# Altium schematic sheet x-.SchDoc
size B
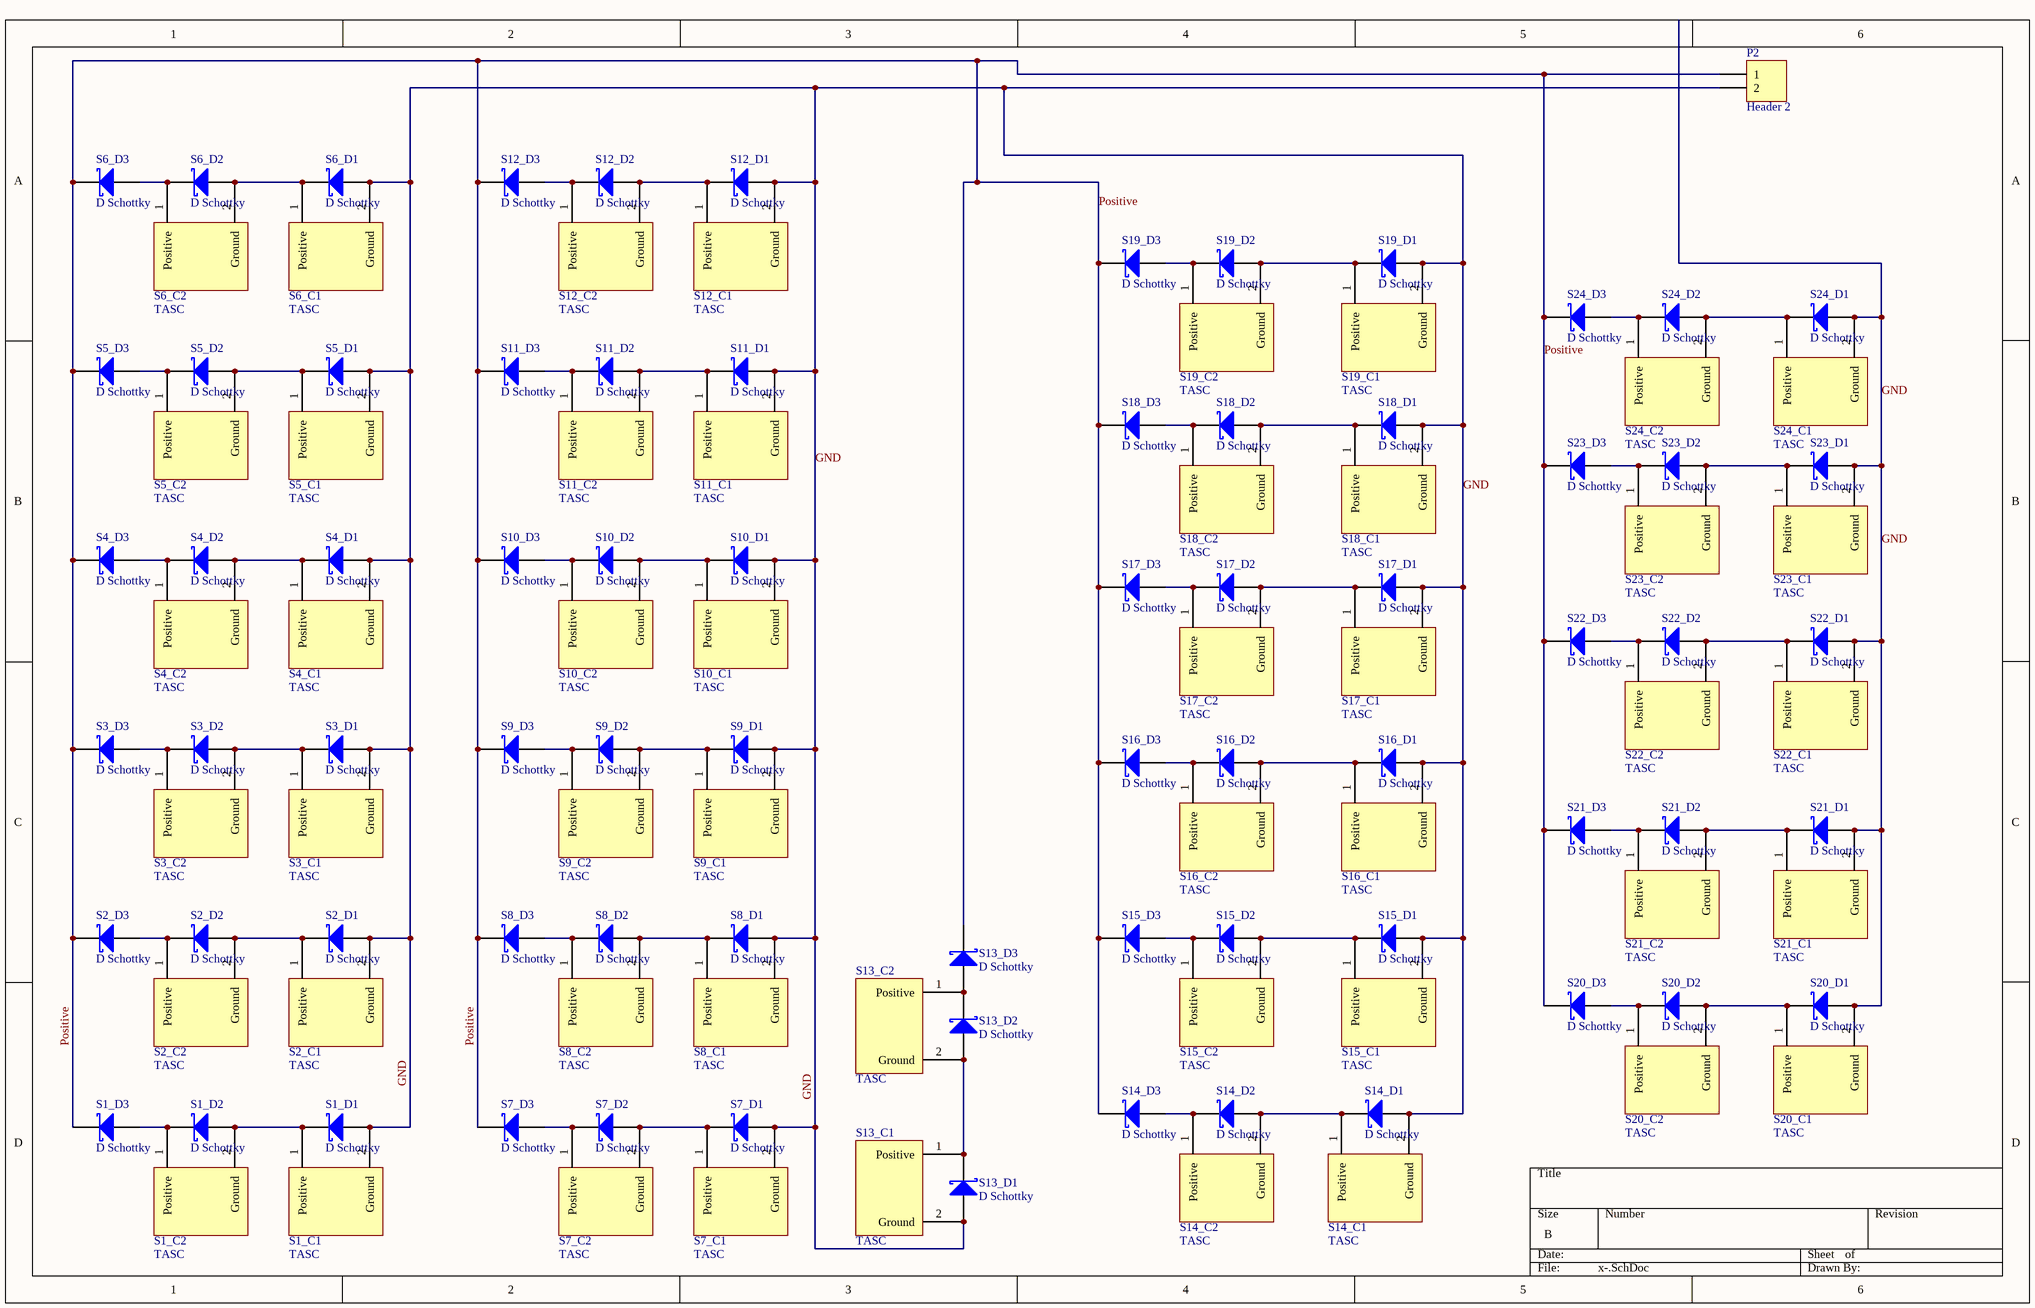
[diagram p0: x-.SchDoc]

## Parts
P2  Header 2  [HDR1X2]
S1_C1  TASC  [PCBComponent_1]
S1_C2  TASC  [PCBComponent_1]
S1_D1  D Schottky  [SMB]
S1_D2  D Schottky  [SMB]
S1_D3  D Schottky  [SMB]
S2_C1  TASC  [PCBComponent_1]
S2_C2  TASC  [PCBComponent_1]
S2_D1  D Schottky  [SMB]
S2_D2  D Schottky  [SMB]
S2_D3  D Schottky  [SMB]
S3_C1  TASC  [PCBComponent_1]
S3_C2  TASC  [PCBComponent_1]
S3_D1  D Schottky  [SMB]
S3_D2  D Schottky  [SMB]
S3_D3  D Schottky  [SMB]
S4_C1  TASC  [PCBComponent_1]
S4_C2  TASC  [PCBComponent_1]
S4_D1  D Schottky  [SMB]
S4_D2  D Schottky  [SMB]
S4_D3  D Schottky  [SMB]
S5_C1  TASC  [PCBComponent_1]
S5_C2  TASC  [PCBComponent_1]
S5_D1  D Schottky  [SMB]
S5_D2  D Schottky  [SMB]
S5_D3  D Schottky  [SMB]
S6_C1  TASC  [PCBComponent_1]
S6_C2  TASC  [PCBComponent_1]
S6_D1  D Schottky  [SMB]
S6_D2  D Schottky  [SMB]
S6_D3  D Schottky  [SMB]
S7_C1  TASC  [PCBComponent_1]
S7_C2  TASC  [PCBComponent_1]
S7_D1  D Schottky  [SMB]
S7_D2  D Schottky  [SMB]
S7_D3  D Schottky  [SMB]
S8_C1  TASC  [PCBComponent_1]
S8_C2  TASC  [PCBComponent_1]
S8_D1  D Schottky  [SMB]
S8_D2  D Schottky  [SMB]
S8_D3  D Schottky  [SMB]
S9_C1  TASC  [PCBComponent_1]
S9_C2  TASC  [PCBComponent_1]
S9_D1  D Schottky  [SMB]
S9_D2  D Schottky  [SMB]
S9_D3  D Schottky  [SMB]
S10_C1  TASC  [PCBComponent_1]
S10_C2  TASC  [PCBComponent_1]
S10_D1  D Schottky  [SMB]
S10_D2  D Schottky  [SMB]
S10_D3  D Schottky  [SMB]
S11_C1  TASC  [PCBComponent_1]
S11_C2  TASC  [PCBComponent_1]
S11_D1  D Schottky  [SMB]
S11_D2  D Schottky  [SMB]
S11_D3  D Schottky  [SMB]
S12_C1  TASC  [PCBComponent_1]
S12_C2  TASC  [PCBComponent_1]
S12_D1  D Schottky  [SMB]
S12_D2  D Schottky  [SMB]
S12_D3  D Schottky  [SMB]
S13_C1  TASC  [PCBComponent_1]
S13_C2  TASC  [PCBComponent_1]
S13_D1  D Schottky  [SMB]
S13_D2  D Schottky  [SMB]
S13_D3  D Schottky  [SMB]
S14_C1  TASC  [PCBComponent_1]
S14_C2  TASC  [PCBComponent_1]
S14_D1  D Schottky  [SMB]
S14_D2  D Schottky  [SMB]
S14_D3  D Schottky  [SMB]
S15_C1  TASC  [PCBComponent_1]
S15_C2  TASC  [PCBComponent_1]
S15_D1  D Schottky  [SMB]
S15_D2  D Schottky  [SMB]
S15_D3  D Schottky  [SMB]
S16_C1  TASC  [PCBComponent_1]
S16_C2  TASC  [PCBComponent_1]
S16_D1  D Schottky  [SMB]
S16_D2  D Schottky  [SMB]
S16_D3  D Schottky  [SMB]
S17_C1  TASC  [PCBComponent_1]
S17_C2  TASC  [PCBComponent_1]
S17_D1  D Schottky  [SMB]
S17_D2  D Schottky  [SMB]
S17_D3  D Schottky  [SMB]
S18_C1  TASC  [PCBComponent_1]
S18_C2  TASC  [PCBComponent_1]
S18_D1  D Schottky  [SMB]
S18_D2  D Schottky  [SMB]
S18_D3  D Schottky  [SMB]
S19_C1  TASC  [PCBComponent_1]
S19_C2  TASC  [PCBComponent_1]
S19_D1  D Schottky  [SMB]
S19_D2  D Schottky  [SMB]
S19_D3  D Schottky  [SMB]
S20_C1  TASC  [PCBComponent_1]
S20_C2  TASC  [PCBComponent_1]
S20_D1  D Schottky  [SMB]
S20_D2  D Schottky  [SMB]
S20_D3  D Schottky  [SMB]
S21_C1  TASC  [PCBComponent_1]
S21_C2  TASC  [PCBComponent_1]
S21_D1  D Schottky  [SMB]
S21_D2  D Schottky  [SMB]
S21_D3  D Schottky  [SMB]
S22_C1  TASC  [PCBComponent_1]
S22_C2  TASC  [PCBComponent_1]
S22_D1  D Schottky  [SMB]
S22_D2  D Schottky  [SMB]
S22_D3  D Schottky  [SMB]
S23_C1  TASC  [PCBComponent_1]
S23_C2  TASC  [PCBComponent_1]
S23_D1  D Schottky  [SMB]
S23_D2  D Schottky  [SMB]
S23_D3  D Schottky  [SMB]
S24_C1  TASC  [PCBComponent_1]
S24_C2  TASC  [PCBComponent_1]
S24_D1  D Schottky  [SMB]
S24_D2  D Schottky  [SMB]
S24_D3  D Schottky  [SMB]

## Nets
GND: P2.2 S1_C1.2(Ground) S1_D1.1(A) S2_C1.2(Ground) S2_D1.1(A) S3_C1.2(Ground) S3_D1.1(A) S4_C1.2(Ground) S4_D1.1(A) S5_C1.2(Ground) S5_D1.1(A) S6_C1.2(Ground) S6_D1.1(A) S7_C1.2(Ground) S7_D1.1(A) S8_C1.2(Ground) S8_D1.1(A) S9_C1.2(Ground) S9_D1.1(A) S10_C1.2(Ground) S10_D1.1(A) S11_C1.2(Ground) S11_D1.1(A) S12_C1.2(Ground) S12_D1.1(A) S13_C1.2(Ground) S13_D1.1(A) S14_C1.2(Ground) S14_D1.1(A) S15_C1.2(Ground) S15_D1.1(A) S16_C1.2(Ground) S16_D1.1(A) S17_C1.2(Ground) S17_D1.1(A) S18_C1.2(Ground) S18_D1.1(A) S19_C1.2(Ground) S19_D1.1(A) S20_C1.2(Ground) S20_D1.1(A) S21_C1.2(Ground) S21_D1.1(A) S22_C1.2(Ground) S22_D1.1(A) S23_C1.2(Ground) S23_D1.1(A) S24_C1.2(Ground) S24_D1.1(A)
Positive: P2.1 S1_D3.2(K) S2_D3.2(K) S3_D3.2(K) S4_D3.2(K) S5_D3.2(K) S6_D3.2(K) S7_D3.2(K) S8_D3.2(K) S9_D3.2(K) S10_D3.2(K) S11_D3.2(K) S12_D3.2(K) S13_D3.2(K) S14_D3.2(K) S15_D3.2(K) S16_D3.2(K) S17_D3.2(K) S18_D3.2(K) S19_D3.2(K) S20_D3.2(K) S21_D3.2(K) S22_D3.2(K) S23_D3.2(K) S24_D3.2(K)
NetS1_C1_1: S1_C1.1(Positive) S1_C2.2(Ground) S1_D1.2(K) S1_D2.1(A)
NetS1_C2_1: S1_C2.1(Positive) S1_D2.2(K) S1_D3.1(A)
NetS2_C1_1: S2_C1.1(Positive) S2_C2.2(Ground) S2_D1.2(K) S2_D2.1(A)
NetS2_C2_1: S2_C2.1(Positive) S2_D2.2(K) S2_D3.1(A)
NetS3_C1_1: S3_C1.1(Positive) S3_C2.2(Ground) S3_D1.2(K) S3_D2.1(A)
NetS3_C2_1: S3_C2.1(Positive) S3_D2.2(K) S3_D3.1(A)
NetS4_C1_1: S4_C1.1(Positive) S4_C2.2(Ground) S4_D1.2(K) S4_D2.1(A)
NetS4_C2_1: S4_C2.1(Positive) S4_D2.2(K) S4_D3.1(A)
NetS5_C1_1: S5_C1.1(Positive) S5_C2.2(Ground) S5_D1.2(K) S5_D2.1(A)
NetS5_C2_1: S5_C2.1(Positive) S5_D2.2(K) S5_D3.1(A)
NetS6_C1_1: S6_C1.1(Positive) S6_C2.2(Ground) S6_D1.2(K) S6_D2.1(A)
NetS6_C2_1: S6_C2.1(Positive) S6_D2.2(K) S6_D3.1(A)
NetS7_C1_1: S7_C1.1(Positive) S7_C2.2(Ground) S7_D1.2(K) S7_D2.1(A)
NetS7_C2_1: S7_C2.1(Positive) S7_D2.2(K) S7_D3.1(A)
NetS8_C1_1: S8_C1.1(Positive) S8_C2.2(Ground) S8_D1.2(K) S8_D2.1(A)
NetS8_C2_1: S8_C2.1(Positive) S8_D2.2(K) S8_D3.1(A)
NetS9_C1_1: S9_C1.1(Positive) S9_C2.2(Ground) S9_D1.2(K) S9_D2.1(A)
NetS9_C2_1: S9_C2.1(Positive) S9_D2.2(K) S9_D3.1(A)
NetS10_C1_1: S10_C1.1(Positive) S10_C2.2(Ground) S10_D1.2(K) S10_D2.1(A)
NetS10_C2_1: S10_C2.1(Positive) S10_D2.2(K) S10_D3.1(A)
NetS11_C1_1: S11_C1.1(Positive) S11_C2.2(Ground) S11_D1.2(K) S11_D2.1(A)
NetS11_C2_1: S11_C2.1(Positive) S11_D2.2(K) S11_D3.1(A)
NetS12_C1_1: S12_C1.1(Positive) S12_C2.2(Ground) S12_D1.2(K) S12_D2.1(A)
NetS12_C2_1: S12_C2.1(Positive) S12_D2.2(K) S12_D3.1(A)
NetS13_C1_1: S13_C1.1(Positive) S13_C2.2(Ground) S13_D1.2(K) S13_D2.1(A)
NetS13_C2_1: S13_C2.1(Positive) S13_D2.2(K) S13_D3.1(A)
NetS14_C1_1: S14_C1.1(Positive) S14_C2.2(Ground) S14_D1.2(K) S14_D2.1(A)
NetS14_C2_1: S14_C2.1(Positive) S14_D2.2(K) S14_D3.1(A)
NetS15_C1_1: S15_C1.1(Positive) S15_C2.2(Ground) S15_D1.2(K) S15_D2.1(A)
NetS15_C2_1: S15_C2.1(Positive) S15_D2.2(K) S15_D3.1(A)
NetS16_C1_1: S16_C1.1(Positive) S16_C2.2(Ground) S16_D1.2(K) S16_D2.1(A)
NetS16_C2_1: S16_C2.1(Positive) S16_D2.2(K) S16_D3.1(A)
NetS17_C1_1: S17_C1.1(Positive) S17_C2.2(Ground) S17_D1.2(K) S17_D2.1(A)
NetS17_C2_1: S17_C2.1(Positive) S17_D2.2(K) S17_D3.1(A)
NetS18_C1_1: S18_C1.1(Positive) S18_C2.2(Ground) S18_D1.2(K) S18_D2.1(A)
NetS18_C2_1: S18_C2.1(Positive) S18_D2.2(K) S18_D3.1(A)
NetS19_C1_1: S19_C1.1(Positive) S19_C2.2(Ground) S19_D1.2(K) S19_D2.1(A)
NetS19_C2_1: S19_C2.1(Positive) S19_D2.2(K) S19_D3.1(A)
NetS20_C1_1: S20_C1.1(Positive) S20_C2.2(Ground) S20_D1.2(K) S20_D2.1(A)
NetS20_C2_1: S20_C2.1(Positive) S20_D2.2(K) S20_D3.1(A)
NetS21_C1_1: S21_C1.1(Positive) S21_C2.2(Ground) S21_D1.2(K) S21_D2.1(A)
NetS21_C2_1: S21_C2.1(Positive) S21_D2.2(K) S21_D3.1(A)
NetS22_C1_1: S22_C1.1(Positive) S22_C2.2(Ground) S22_D1.2(K) S22_D2.1(A)
NetS22_C2_1: S22_C2.1(Positive) S22_D2.2(K) S22_D3.1(A)
NetS23_C1_1: S23_C1.1(Positive) S23_C2.2(Ground) S23_D1.2(K) S23_D2.1(A)
NetS23_C2_1: S23_C2.1(Positive) S23_D2.2(K) S23_D3.1(A)
NetS24_C1_1: S24_C1.1(Positive) S24_C2.2(Ground) S24_D1.2(K) S24_D2.1(A)
NetS24_C2_1: S24_C2.1(Positive) S24_D2.2(K) S24_D3.1(A)

## Library data of the parts
P2 = Header 2: Header, 2-Pin; LatestRevisionDate: 17-Jul-2002; LatestRevisionNote: Re-released for DXP Platform.; Publisher: Altium Limited
S1_C1 S1_C2 S2_C1 S2_C2 S3_C1 S3_C2 S4_C1 S4_C2 S5_C1 S5_C2 S6_C1 S6_C2 S7_C1 S7_C2 S8_C1 S8_C2 S9_C1 S9_C2 S10_C1 S10_C2 S11_C1 S11_C2 S12_C1 S12_C2 S13_C1 S13_C2 S14_C1 S14_C2 S15_C1 S15_C2 S16_C1 S16_C2 S17_C1 S17_C2 S18_C1 S18_C2 S19_C1 S19_C2 S20_C1 S20_C2 S21_C1 S21_C2 S22_C1 S22_C2 S23_C1 S23_C2 S24_C1 S24_C2 = TASC: TASC Solar Cell
S1_D1-S1_D3 S2_D1-S2_D3 S3_D1-S3_D3 S4_D1-S4_D3 S5_D1-S5_D3 S6_D1-S6_D3 S7_D1-S7_D3 S8_D1-S8_D3 S9_D1-S9_D3 S10_D1-S10_D3 S11_D1-S11_D3 S12_D1-S12_D3 S13_D1-S13_D3 S14_D1-S14_D3 S15_D1-S15_D3 S16_D1-S16_D3 S17_D1-S17_D3 S18_D1-S18_D3 S19_D1-S19_D3 S20_D1-S20_D3 S21_D1-S21_D3 S22_D1-S22_D3 S23_D1-S23_D3 S24_D1-S24_D3 = D Schottky: Schottky Diode; Published: 8-Jun-2000; LatestRevisionDate: 17-Jul-2002; LatestRevisionNote: Re-released for DXP Platform.; PackageReference: SMB; Publisher: Altium Limited; PackageDescription: DO-214-AA/SMB; 2 C-Bend Leads; Body 5.3 x 3.6 mm, inc. leads (LxW); Code_JEDEC: DO-214-AA